# Altium schematic sheet [03] - MCU.SchDoc: MCU
size A3; Author: Gabriel Piñango; DocumentNumber: 3; Revision: V1I1; SheetNumber: 3; SheetTotal: 6; Collaborator: Gabriel Pinango; Project: MultiTestcard; VersionRevision: V1I1; Designer: Gabriel Pinango
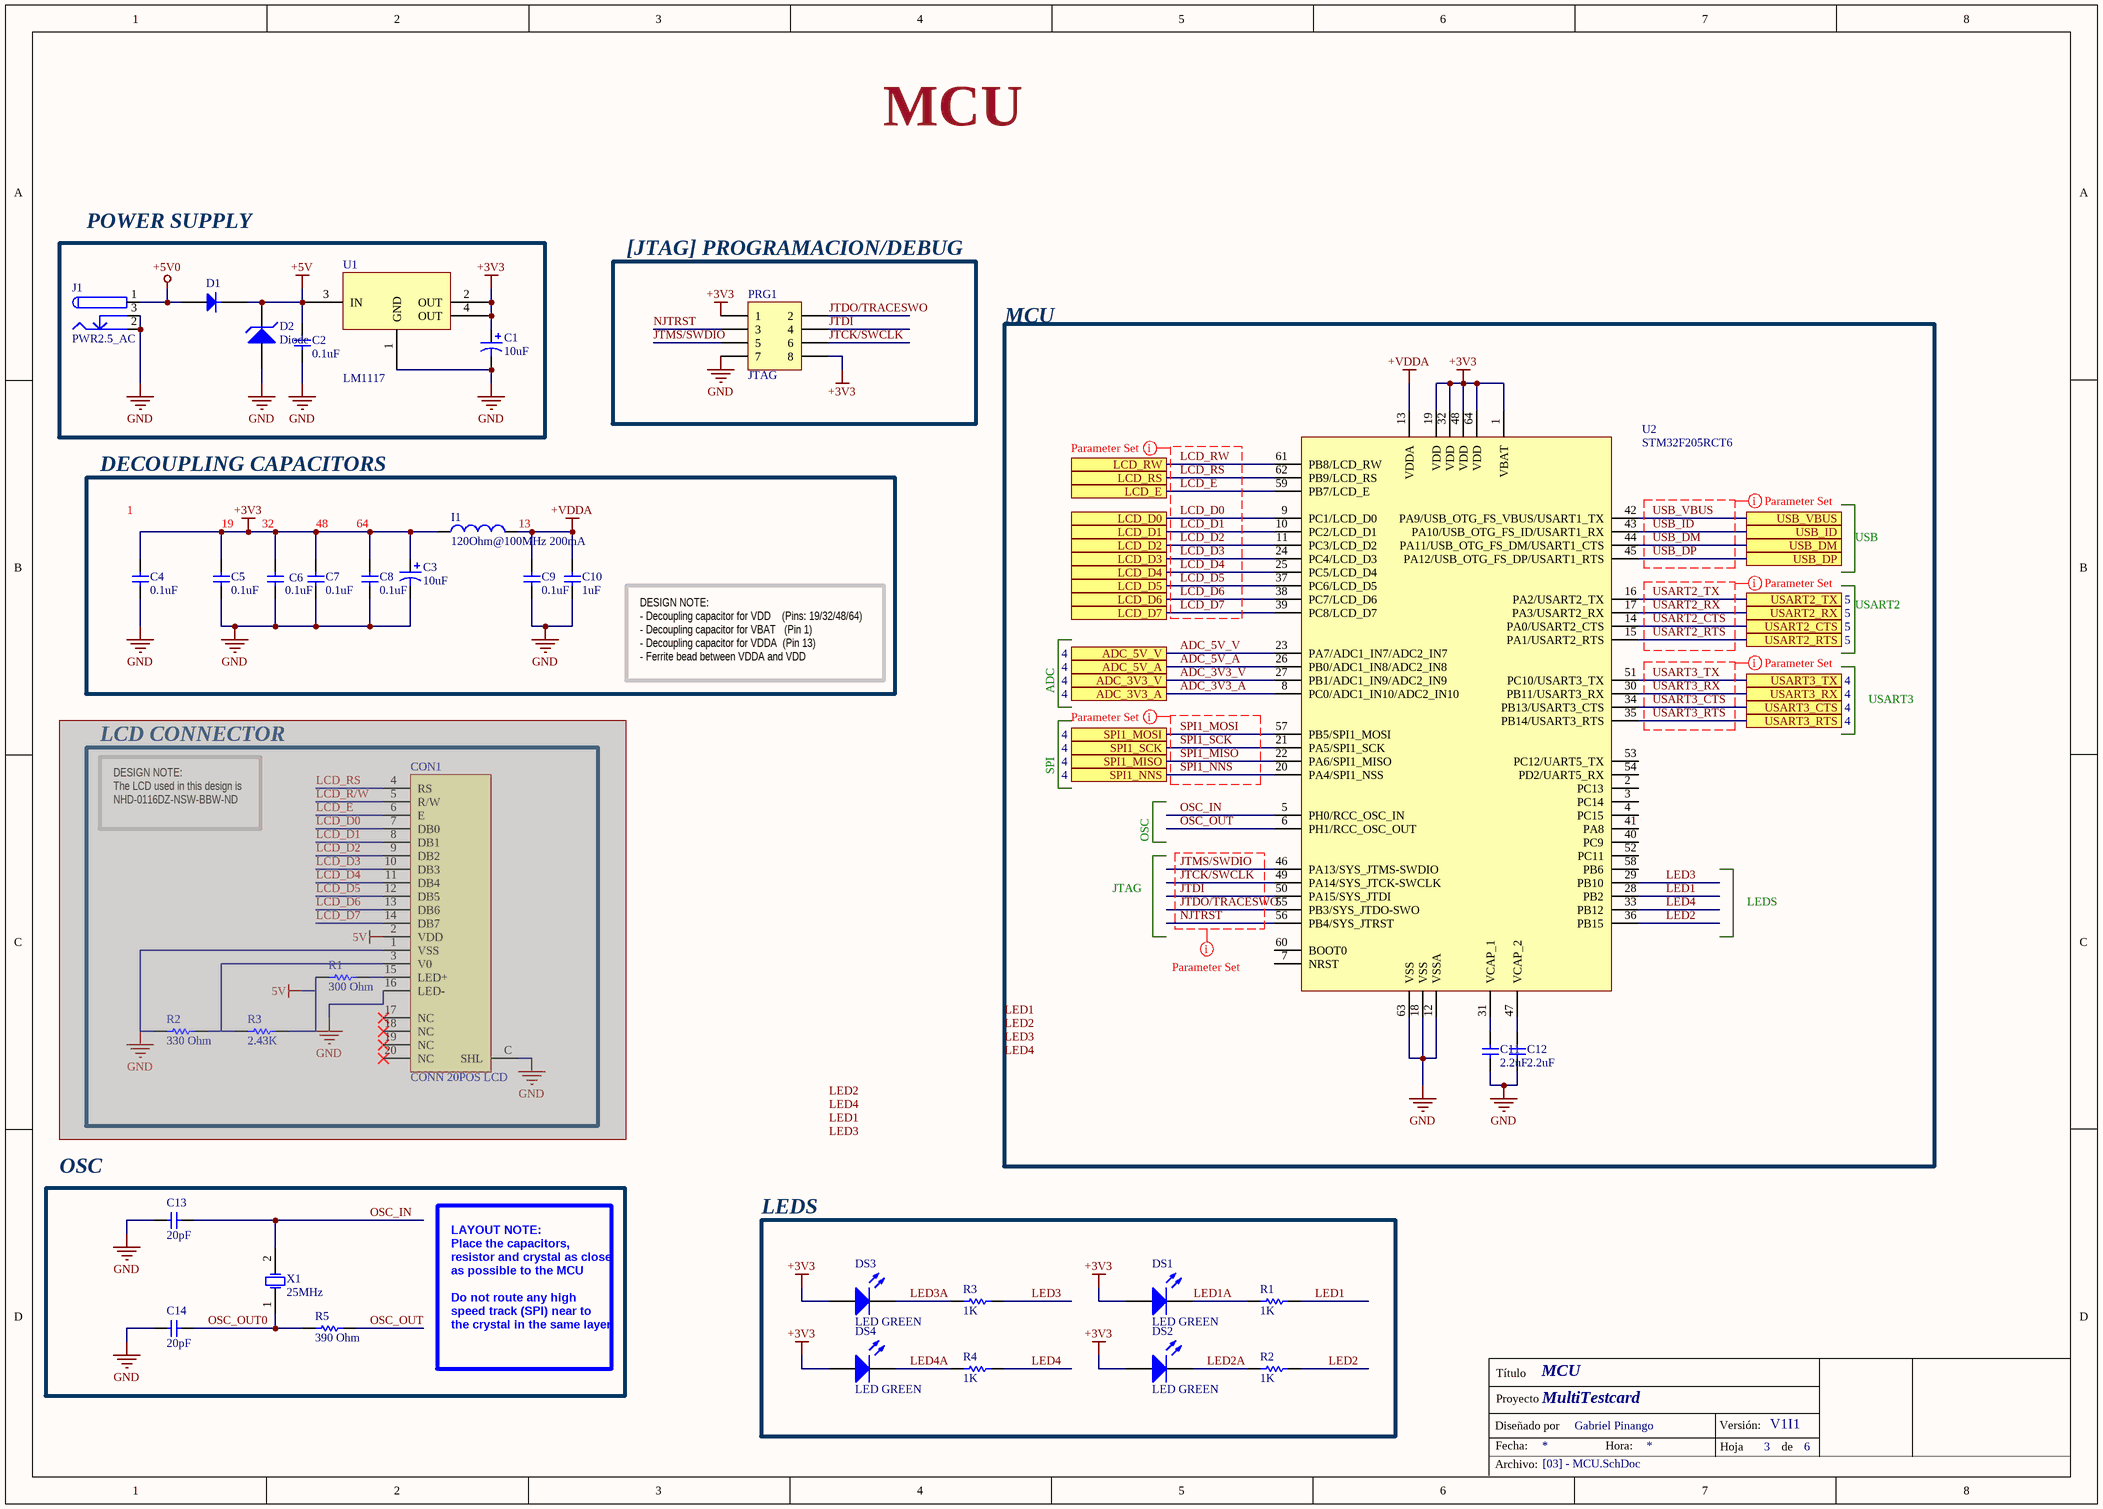
[diagram p0: [03] - MCU.SchDoc]

## Parts
(Parts that share a designator on the sheet are numbered #1, #2 ... from top to bottom, then left to right.)
C1  10uF  [CC2012-0805]
C2  0.1uF  [CC-0603]
C3  10uF  [CC2012-0805]
C4  0.1uF  [CC-0603]
C5  0.1uF  [CC-0603]
C6  0.1uF  [CC-0603]
C7  0.1uF  [CC-0603]
C8  0.1uF  [CC-0603]
C9  0.1uF  [CC-0603]
C10  1uF  [CC-0603]
C11  2.2uF  [CC-0603]
C12  2.2uF  [CC-0603]
C13  20pF  [CC-0603]
C14  20pF  [CC-0603]
CON1  CONN 20POS LCD  [CON20_1X20_DUT_58XF_GLE]  (masked out: inside a compile mask, not in the netlist)
D1  1N4148W-TP  [SOD123]  (value not drawn)
D2  Diode  [SOD-523]
DS1  LED GREEN  [LED-SMD-0805]
DS2  LED GREEN  [LED-SMD-0805]
DS3  LED GREEN  [LED-SMD-0805]
DS4  LED GREEN  [LED-SMD-0805]
I1  120Ohm@100MHz 200mA  [L-0805]
J1  PWR2.5_AC  [KLD-0202-AC]
PRG1  JTAG  [20021311-00008T4LF]
R1#1  300 Ohm  [R-0603]  (masked out: inside a compile mask, not in the netlist)
R1#2  1K  [R-0603]
R2#1  330 Ohm  [R-0603]  (masked out: inside a compile mask, not in the netlist)
R2#2  1K  [R-0603]
R3#1  2.43K  [R-0603]  (masked out: inside a compile mask, not in the netlist)
R3#2  1K  [R-0603]
R4  1K  [R-0603]
R5  390 Ohm  [R-0603]
U1  LM1117  [SOT223]
U2  STM32F205RCT6  [64-LQFP]
X1  25MHz  [ABM3 CRYSTAL]

## Blocks framed on the sheet
POWER SUPPLY: C1 C2 D1 D2 J1 U1
[JTAG] PROGRAMACION/DEBUG: PRG1
MCU: C11 C12 U2
DECOUPLING CAPACITORS: C3-C10 I1
LCD CONNECTOR: CON1 R1#1 R2#1 R3#1
OSC: C13 C14 R5 X1
LEDS: DS1-DS4 R1#2 R2#2 R3#2 R4

## Ports
ADC_3V3_A (see 4), ADC_3V3_V (see 4), ADC_5V_A (see 4), ADC_5V_V (see 4), LCD_D0, LCD_D1, LCD_D2, LCD_D3, LCD_D4, LCD_D5, LCD_D6, LCD_D7, LCD_E, LCD_RS, LCD_RW, SPI1_MISO (see 4), SPI1_MOSI (see 4), SPI1_NNS (see 4), SPI1_SCK (see 4), USART2_CTS (see 5), USART2_RTS (see 5), USART2_RX (see 5), USART2_TX (see 5), USART3_CTS (see 4), USART3_RTS (see 4), USART3_RX (see 4), USART3_TX (see 4), USB_DM, USB_DP, USB_ID, USB_VBUS

## Nets
+3V3: C1.1 C3.1 C4.1 C5.1 C6.1 C7.1 C8.1 DS1.2(A) DS2.2(A) DS3.2(A) DS4.2(A) I1.1 PRG1.1 PRG1.8 U1.2(OUT) U1.4(OUT) U2.1(VBAT) U2.19(VDD) U2.32(VDD) U2.48(VDD) U2.64(VDD)
+5V: C2.1 D1.2(K) D2.2(K) U1.3(IN)
+5V0: D1.1(A) J1.1
+VDDA: C9.1 C10.1 I1.2 U2.13(VDDA)
GND: C1.2 C2.2 C3.2 C4.2 C5.2 C6.2 C7.2 C8.2 C9.2 C10.2 C11.2 C12.2 C13.2 C14.2 D2.1(A) J1.2 J1.3 PRG1.7 U1.1(GND) U2.12(VSSA) U2.18(VSS) U2.63(VSS)
ADC_3V3_A: U2.8(PC0/ADC1_IN10/ADC2_IN10) ; port ADC_3V3_A
ADC_3V3_V: U2.27(PB1/ADC1_IN9/ADC2_IN9) ; port ADC_3V3_V
ADC_5V_A: U2.26(PB0/ADC1_IN8/ADC2_IN8) ; port ADC_5V_A
ADC_5V_V: U2.23(PA7/ADC1_IN7/ADC2_IN7) ; port ADC_5V_V
JTCK/SWCLK: PRG1.6 U2.49(PA14/SYS_JTCK-SWCLK)
JTDI: PRG1.4 U2.50(PA15/SYS_JTDI)
JTDO/TRACESWO: PRG1.2 U2.55(PB3/SYS_JTDO-SWO)
JTMS/SWDIO: PRG1.5 U2.46(PA13/SYS_JTMS-SWDIO)
LCD_D0: U2.9(PC1/LCD_D0) ; port LCD_D0
LCD_D1: U2.10(PC2/LCD_D1) ; port LCD_D1
LCD_D2: U2.11(PC3/LCD_D2) ; port LCD_D2
LCD_D3: U2.24(PC4/LCD_D3) ; port LCD_D3
LCD_D4: U2.25(PC5/LCD_D4) ; port LCD_D4
LCD_D5: U2.37(PC6/LCD_D5) ; port LCD_D5
LCD_D6: U2.38(PC7/LCD_D6) ; port LCD_D6
LCD_D7: U2.39(PC8/LCD_D7) ; port LCD_D7
LCD_E: U2.59(PB7/LCD_E) ; port LCD_E
LCD_RS: U2.62(PB9/LCD_RS) ; port LCD_RS
LCD_RW: U2.61(PB8/LCD_RW) ; port LCD_RW
LED1: R1#2.2 U2.28(PB2)
LED1A: DS1.1(K) R1#2.1
LED2: R2#2.2 U2.36(PB15)
LED2A: DS2.1(K) R2#2.1
LED3: R3#2.2 U2.29(PB10)
LED3A: DS3.1(K) R3#2.1
LED4: R4.2 U2.33(PB12)
LED4A: DS4.1(K) R4.1
NJTRST: PRG1.3 U2.56(PB4/SYS_JTRST)
OSC_IN: C13.1 U2.5(PH0/RCC_OSC_IN) X1.2(OSC2)
OSC_OUT: R5.2 U2.6(PH1/RCC_OSC_OUT)
OSC_OUT0: C14.1 R5.1 X1.1(OSC1)
SPI1_MISO: U2.22(PA6/SPI1_MISO) ; port SPI1_MISO
SPI1_MOSI: U2.57(PB5/SPI1_MOSI) ; port SPI1_MOSI
SPI1_NNS: U2.20(PA4/SPI1_NSS) ; port SPI1_NNS
SPI1_SCK: U2.21(PA5/SPI1_SCK) ; port SPI1_SCK
USART2_CTS: U2.14(PA0/USART2_CTS) ; port USART2_CTS
USART2_RTS: U2.15(PA1/USART2_RTS) ; port USART2_RTS
USART2_RX: U2.17(PA3/USART2_RX) ; port USART2_RX
USART2_TX: U2.16(PA2/USART2_TX) ; port USART2_TX
USART3_CTS: U2.34(PB13/USART3_CTS) ; port USART3_CTS
USART3_RTS: U2.35(PB14/USART3_RTS) ; port USART3_RTS
USART3_RX: U2.30(PB11/USART3_RX) ; port USART3_RX
USART3_TX: U2.51(PC10/USART3_TX) ; port USART3_TX
USB_DM: U2.44(PA11/USB_OTG_FS_DM/USART1_CTS) ; port USB_DM
USB_DP: U2.45(PA12/USB_OTG_FS_DP/USART1_RTS) ; port USB_DP
USB_ID: U2.43(PA10/USB_OTG_FS_ID/USART1_RX) ; port USB_ID
USB_VBUS: U2.42(PA9/USB_OTG_FS_VBUS/USART1_TX) ; port USB_VBUS
NetC11_1: C11.1 U2.31(VCAP_1)
NetC12_1: C12.1 U2.47(VCAP_2)

Not connected (* = marked no-connect by the designer): U2 2(PC13) 3(PC14) 4(PC15) 7(NRST) 40(PC9) 41(PA8) 52(PC11) 53(PC12/UART5_TX) 54(PD2/UART5_RX) 58(PB6) 60(BOOT0)

## Layout directives
net class USART2: USART2_CTS, USART2_RTS, USART2_RX, USART2_TX
net class USB: USB_DM, USB_DP, USB_ID, USB_VBUS
net class USART3: USART3_CTS, USART3_RTS, USART3_RX, USART3_TX
net class SPI1: SPI1_MISO, SPI1_MOSI, SPI1_NNS, SPI1_SCK
net class JTAG: JTCK/SWCLK, JTDI, JTDO/TRACESWO, JTMS/SWDIO, NJTRST
net class LCD: LCD_D0, LCD_D1, LCD_D2, LCD_D3, LCD_D4, LCD_D5, LCD_D6, LCD_D7, LCD_E, LCD_RS, LCD_RW

## Notes on the sheet
- MCU
- 1
- 19
- 32
- 48
- 64
- (near I1) 13
- USB
- USART2
- DESIGN NOTE:
  - Decoupling capacitor for VDD    (Pins: 19/32/48/64)
  - Decoupling capacitor for VBAT   (Pin 1)
  - Decoupling capacitor for VDDA  (Pin 13)
  - Ferrite bead between VDDA and VDD
- ADC
- USART3
- SPI
- DESIGN NOTE:
  The LCD used in this design is NHD-0116DZ-NSW-BBW-ND
- OSC
- JTAG
- LEDS
- LAYOUT NOTE:
  Place the capacitors, resistor and crystal as close as possible to the MCU
  Do not route any high speed track (SPI) near to the crystal in the same layer
- Labels drawn without touching a wire or pin: LED1, LED2, LED3, LED4
- Título
- Diseñado por
- Fecha:
- Proyecto
- Hora:
- Versión:
- Hoja
- de
- Archivo:

## Library data of the parts
C1 C3 = TCP0J106M8R: CAP TANT 10UF 6.3V 20% 0805; Manufacturer: Rohm; ESR (Equivalent Series Resistance): 8.3R; Supplier 1: Digi-Key; Supplier Part Number 1: 511-1447-6-ND; Manufacturer Part Number: TCP0J106M8R; Stock 1: 89891; Pricing 1: 1=0.46, 10=0.316, 100=0.1898, 500=0.1423, 1000=0.1202 (USD); Mount: Surface Mount; Case/Package: 0805; Case Code (Metric): 2012; Case Code (Imperial): 0805; Min Operating Temperature: -55°C; Max Operating Temperature: 125°C; Capacitance: 10uF; Tolerance: 20%; Package Quantity: 1; Voltage Rating: 6.3V; Packaging: Tape and Reel; Voltage Rating (DC): 6.3V; Features: General Purpose; Length: 0.079inch; Width: 0.049inch; Height - Seated (Max): 0.047inch; Lead Free: Lead Free; ComponentLink1URL: http://rohmfs.rohm.com/en/products/databook/datasheet/passive/tantalum_capacitor/tantalum_chip_capacitor/tc_p.pdf?src-supplier=Future+Electronics; ComponentLink1Description: http://rohmfs.rohm.com/en/products/databook/datasheet/passive/tantalum_capacitor/tantalum_chip_capacitor/tc_p.pdf?src-supplier=Future+Electronics
C2 C4-C9 = CGA3E2X7R1H104K080AA: CAP CER 0.1uF 50V X7R 0603; Manufacturer: TDK; Capacitance: 100nF; Tolerance: 10%; Supplier 1: Digi-Key; Manufacturer Part Number: CGA3E2X7R1H104K080AA; Stock 1: 11580568; Pricing 1: 1=0.1, 10=0.075, 100=0.0335, 500=0.0239, 1000=0.0188 (USD); Mount: Surface Mount; Case/Package: 0603; Case Code (Metric): 1608; Case Code (Imperial): 0603; Min Operating Temperature: -55°C; Max Operating Temperature: 125°C; Package Quantity: 1; Voltage Rating: 50V; Packaging: Tape and Reel; Dielectric: X7R; Termination: SMD/SMT; Voltage: 50V; Length: 1.6mm; Height: 0.8mm; Width: 0.8mm; Thickness: 0.035inch; Depth: 0.8mm; Radiation Hardening: No; REACH SVHC: No SVHC; Lead Free: Lead Free; ComponentLink1URL: http://www.farnell.com/datasheets/1796654.pdf?src-supplier=Mouser; ComponentLink1Description: http://www.farnell.com/datasheets/1796654.pdf?src-supplier=Mouser; ComponentLink2URL: http://product.tdk.com/capacitor/mlcc/en/documents/mlccspec_automotive_general_midvoltage_en.pdf?src-supplier=Future+Electronics; ComponentLink2Description: http://product.tdk.com/capacitor/mlcc/en/documents/mlccspec_automotive_general_midvoltage_en.pdf?src-supplier=Future+Electronics; ComponentLink3URL: http://www.farnell.com/datasheets/1735392.pdf?src-supplier=Element14; ComponentLink3Description: http://www.farnell.com/datasheets/1735392.pdf?src-supplier=Element14; ComponentLink4URL: https://www.verical.com/server-webapp/html/getDatasheet?partID=715867&src-supplier=Verical; ComponentLink4Description: https://www.verical.com/server-webapp/html/getDatasheet?partID=715867&src-supplier=Verical; Supplier Part Number 1: 445-5666-6-ND; Weight: 7.1E-05oz; Voltage Rating (DC): 50V; Composition: Ceramic; Ratings: AEC-Q200; ComponentLink5URL: http://www.farnell.com/datasheets/1796654.pdf?src-supplier=Newark; ComponentLink5Description: http://www.farnell.com/datasheets/1796654.pdf?src-supplier=Newark
C10 = C1608X5R1H105K080AB: CAP CER 1uF 50V X5R 0603; Manufacturer: TDK; Dielectric Material: Ceramic; Tolerance: 10%; Supplier 1: Digi-Key; Manufacturer Part Number: C1608X5R1H105K080AB; Stock 1: 233012; Pricing 1: 1=0.25, 10=0.171, 100=0.0865, 500=0.0592, 1000=0.0524 (USD); Mount: Surface Mount; Case/Package: 0603; Number of Pins: 2; Weight: 7.1E-05oz; Case Code (Metric): 1608; Case Code (Imperial): 0603; Min Operating Temperature: -55°C; Max Operating Temperature: 85°C; Capacitance: 1uF; Packaging: Tape and Reel; Voltage Rating: 50V; Package Quantity: 1; Voltage Rating (DC): 50V; Dielectric: X5R; Termination: SMD/SMT; Voltage: 50V; Composition: Ceramic; Length: 1.6mm; Height: 0.8mm; Width: 0.031inch; Thickness: 0.035inch; Depth: 0.8mm; Radiation Hardening: No; REACH SVHC: No SVHC; Lead Free: Lead Free; ComponentLink1URL: http://www.tdk.co.jp/tefe02/e412_c.pdf?src-supplier=Avnet+Europe; ComponentLink1Description: http://www.tdk.co.jp/tefe02/e412_c.pdf?src-supplier=Avnet+Europe; ComponentLink2URL: https://product.tdk.com/info/en/catalog/spec/mlccspec_commercial_general_midvoltage_en.pdf?src-supplier=Digi-Key; ComponentLink2Description: https://product.tdk.com/info/en/catalog/spec/mlccspec_commercial_general_midvoltage_en.pdf?src-supplier=Digi-Key; ComponentLink3URL: http://www.farnell.com/datasheets/1913358.pdf?src-supplier=Element14; ComponentLink3Description: http://www.farnell.com/datasheets/1913358.pdf?src-supplier=Element14; Supplier Part Number 1: 445-7468-6-ND
C11 C12 = C0603C225K4PACTU: KEMET - C0603C225K4PACTU - CAP, MLCC, X5R, 2.2UF, 16V, 0603; Dielectric Material: Ceramic; Tolerance: 10%; Dissipation Factor: 5%; Supplier 1: Digi-Key; Manufacturer: KEMET; Manufacturer Part Number: C0603C225K4PACTU; Stock 1: 49901; Pricing 1: 1=0.16, 10=0.112, 100=0.0528, 500=0.037, 1000=0.0307 (USD); Mount: Surface Mount; Case/Package: 0603; Number of Pins: 2; Case Code (Imperial): 0603; Case Code (Metric): 1608; Contact Plating: Tin,Matte; Min Operating Temperature: -55°C; Max Operating Temperature: 85°C; Capacitance: 2.2uF; Voltage Rating: 16V; Voltage Rating (DC): 16V; Packaging: Tape and Reel; Package Quantity: 1; Dielectric: X5R; Termination: SMD/SMT; Voltage: 16V; Length: 1.6mm; Height: 0.8mm; Width: 0.8mm; Thickness: 0.034inch; Depth: 0.8mm; Radiation Hardening: No; REACH SVHC: No SVHC; Lead Free: Lead Free; ComponentLink1URL: http://www.farnell.com/datasheets/2739684.pdf?src-supplier=Farnell; ComponentLink1Description: http://www.farnell.com/datasheets/2739684.pdf?src-supplier=Farnell; ComponentLink2URL: http://www.farnell.com/datasheets/2123797.pdf?src-supplier=Element14; ComponentLink2Description: http://www.farnell.com/datasheets/2123797.pdf?src-supplier=Element14; Supplier Part Number 1: 399-7886-1-ND
C13 C14 = CC0603JRNPO9BN200: CAP CER 20PF 50V C0G/NPO 0603; Manufacturer: Yageo; Tolerance: 5%; Dielectric: C0G; Supplier 1: Digi-Key; Manufacturer Part Number: CC0603JRNPO9BN200; Stock 1: 223075; Pricing 1: 1=0.1, 10=0.048, 100=0.0214, 500=0.0153, 1000=0.012 (USD); Mount: Surface Mount; Case/Package: 0603; Number of Pins: 2; Weight: 7.1E-05oz; Case Code (Imperial): 0603; Case Code (Metric): 1608; Min Operating Temperature: -55°C; Max Operating Temperature: 125°C; Capacitance: 20pF; Package Quantity: 4000; Voltage Rating (DC): 50V; Packaging: Tape and Reel; Voltage Rating: 50V; Termination: SMD/SMT; Composition: Ceramic; Length: 1.6mm; Width: 0.8mm; Thickness: 0.035inch; Depth: 0.8mm; REACH SVHC: Unknown; Lead Free: Lead Free; ComponentLink1URL: http://www.farnell.com/datasheets/1132289.pdf?src-supplier=Element14; ComponentLink1Description: http://www.farnell.com/datasheets/1132289.pdf?src-supplier=Element14; ComponentLink2URL: http://www.yageo.com/documents/recent/UPY-GP_NP0_16V-to-50V_16.pdf?src-supplier=Digi-Key; ComponentLink2Description: http://www.yageo.com/documents/recent/UPY-GP_NP0_16V-to-50V_16.pdf?src-supplier=Digi-Key; Supplier Part Number 1: 311-1424-6-ND
CON1 = 62674-201121ALF: CONN FFC VERT 20POS 0.50MM SMD; Manufacturer: Amphenol FCI; Actuator Material: Plastic,Glass; Contact Resistance: 30mR; Voltage Rating: 50V; Current Rating: 500mA; Gender: Receptacle; Number of Positions: 20; Insulation Resistance: 100MR; Wire/Cable Type: Straight; Pitch: 1mm; Supplier 1: Digi-Key; Manufacturer Part Number: 62674-201121ALF; Stock 1: 37230; Pricing 1: 1=0.74, 10=0.65, 25=0.6124, 50=0.5868, 100=0.5612, 250=0.5102, 500=0.4592 (USD); Mount: Surface Mount; Contact Material: Bronze; Contact Plating: Gold; Housing Color: Black; Housing Material: Resin; Min Operating Temperature: -55°C; Max Operating Temperature: 85°C; Number of Rows: 1; Packaging: Tape and Reel; Package Quantity: 1000; Termination: Solder; Max Voltage Rating (AC): 50V; Max Voltage Rating (DC): 50V; Number of Contacts: 20; Orientation: Straight; Length: 14.5mm; Depth: 2.95mm; Width: 2.95mm; Radiation Hardening: No; REACH SVHC: No SVHC; Lead Free: Lead Free; Flammability Rating: UL94 V-0; ComponentLink1URL: http://www.mouser.com/ds/2/154/62674-26092.pdf?src-supplier=Mouser; ComponentLink1Description: http://www.mouser.com/ds/2/154/62674-26092.pdf?src-supplier=Mouser; ComponentLink2URL: http://portal.fciconnect.com/Comergent//fci/drawing/62674.pdf?src-supplier=Digi-Key; ComponentLink2Description: http://portal.fciconnect.com/Comergent//fci/drawing/62674.pdf?src-supplier=Digi-Key; ComponentLink3URL: https://cdn.amphenol-icc.com/media/wysiwyg/files/drawing/62674.pdf?src-supplier=Digi-Key; ComponentLink3Description: https://cdn.amphenol-icc.com/media/wysiwyg/files/drawing/62674.pdf?src-supplier=Digi-Key; ComponentLink4URL: http://portal.fciconnect.com/Comergent/fci/drawing/62674.pdf?src-supplier=Avnet; ComponentLink4Description: http://portal.fciconnect.com/Comergent/fci/drawing/62674.pdf?src-supplier=Avnet; ComponentLink5URL: http://portal.fciconnect.com/Comergent/fci/drawing/62674.pdf?src-supplier=Avnet+Asia; ComponentLink5Description: http://portal.fciconnect.com/Comergent/fci/drawing/62674.pdf?src-supplier=Avnet+Asia; Supplier Part Number 1: 609-1207-1-ND
D1 = 1N4148W-TP: DIODE SWITCH 100V 0.15A SOD123; Manufacturer: MCC; Max Current Consumption: 1uA; Max Surge Current: 2A; Forward Voltage: 1V; Forward Current: 150mA; Recovery Time: 4ns; Max Reverse Leakage Current: 5uA; Power Dissipation: 400mW; Max Forward Surge Current (Ifsm): 1A; Element Configuration: Single; Polarity: Standard; Capacitance: 4pF; Supplier 1: Digi-Key; Supplier Part Number 1: 1N4148WTPMSCT-ND; Manufacturer Part Number: 1N4148W-TP; Stock 1: 337039; Pricing 1: 1=0.17, 10=0.158, 100=0.066, 500=0.0518, 1000=0.036 (USD); Mount: Surface Mount; Number of Pins: 2; Min Operating Temperature: -65°C; Max Operating Temperature: 150°C; Packaging: Tape and Reel; Package Quantity: 3000; Average Rectified Current: 150mA; Reverse Recovery Time: 4ns; Max Repetitive Reverse Voltage (Vrrm): 100V; Peak Non-Repetitive Surge Current: 2A; Voltage Rating (DC): 100V; Current Rating: 150mA; Output Current: 150mA; Max Reverse Voltage (DC): 100V; Length: 2.85mm; Width: 1.8mm; Height: 1.2mm; Radiation Hardening: No; REACH SVHC: Unknown; Lead Free: Lead Free; ComponentLink1URL: http://www.farnell.com/datasheets/1684829.pdf?src-supplier=Newark; ComponentLink1Description: http://www.farnell.com/datasheets/1684829.pdf?src-supplier=Newark; ComponentLink2URL: http://www.mccsemi.com/up_pdf/1N4148W(SOD123).pdf?src-supplier=Future+Electronics; ComponentLink2Description: http://www.mccsemi.com/up_pdf/1N4148W(SOD123).pdf?src-supplier=Future+Electronics; ComponentLink3URL: http://www.mouser.com/ds/2/258/1N4148W(SOD123)-349435.pdf?src-supplier=Mouser; ComponentLink3Description: http://www.mouser.com/ds/2/258/1N4148W(SOD123)-349435.pdf?src-supplier=Mouser; ComponentLink4URL: http://www.alliedelec.com/images/products/datasheets/bm/MCC/70055519.pdf?src-supplier=Allied+Electronics; ComponentLink4Description: http://www.alliedelec.com/images/products/datasheets/bm/MCC/70055519.pdf?src-supplier=Allied+Electronics; ComponentLink5URL: http://www.mccsemi.com/up_pdf/1N4148W(SOD123).pdf?src-supplier=Digi-Key; ComponentLink5Description: http://www.mccsemi.com/up_pdf/1N4148W(SOD123).pdf?src-supplier=Digi-Key; ComponentLink6URL: http://www.farnell.com/datasheets/1684829.pdf?src-supplier=Element14; ComponentLink6Description: http://www.farnell.com/datasheets/1684829.pdf?src-supplier=Element14
D2 = UCLAMP0501H.TCT: TVS DIODE 5VWM 12.5VC SOD523; Manufacturer: Semtech; Capacitance: 160pF; Number of Channels: 1; Direction: Unidirectional; Reverse Breakdown Voltage: 6V; Reverse Standoff Voltage: 5V; Clamping Voltage: 12.5V; Peak Pulse Power: 240W; Power Line Protection: No; Leakage Current: 5uA; Peak Pulse Current: 16A; Test Current: 1mA; Element Configuration: Single; Supplier 1: Digi-Key; Supplier Part Number 1: UCLAMP0501HDKR-ND; Manufacturer Part Number: UCLAMP0501H.TCT; Stock 1: 29145; Pricing 1: 1=0.58, 10=0.51, 25=0.4788, 100=0.3909, 250=0.3631, 500=0.309, 1000=0.2472 (USD); Mount: Surface Mount; Number of Pins: 2; Min Operating Temperature: -55°C; Max Operating Temperature: 125°C; Packaging: Tape and Reel; Number of Elements: 1; Number of Unidirectional Channels: 1; Min Breakdown Voltage: 6V; Max Breakdown Voltage: 6V; Working Voltage: 5V; Polarity: Unidirectional; Breakdown Voltage: 6V; Max Power Dissipation: 240W; Voltage Rating (DC): 5V; Composition: Zener; Length: 1.3mm; Depth: 0.9mm; Width: 900um; Radiation Hardening: No; REACH SVHC: No SVHC; Lead Free: Lead Free; ComponentLink1URL: http://www.semtech.com/images/datasheet/uclamp0501h.pdf?src-supplier=Future+Electronics; ComponentLink1Description: http://www.semtech.com/images/datasheet/uclamp0501h.pdf?src-supplier=Future+Electronics; ComponentLink2URL: https://www.verical.com/server-webapp/html/getDatasheet?partID=51047&src-supplier=Verical; ComponentLink2Description: https://www.verical.com/server-webapp/html/getDatasheet?partID=51047&src-supplier=Verical; ComponentLink3URL: http://www.semtech.com/images/datasheet/uclamp0501h.pdf?src-supplier=Digi-Key; ComponentLink3Description: http://www.semtech.com/images/datasheet/uclamp0501h.pdf?src-supplier=Digi-Key; ComponentLink4URL: https://www.semtech.com/uploads/documents/uclamp0501h.pdf?src-supplier=Digi-Key; ComponentLink4Description: https://www.semtech.com/uploads/documents/uclamp0501h.pdf?src-supplier=Digi-Key; ComponentLink5URL: http://www.semtech.com/images/datasheet/uclamp0501h.pdf?src-supplier=Element14; ComponentLink5Description: http://www.semtech.com/images/datasheet/uclamp0501h.pdf?src-supplier=Element14; ComponentLink6URL: http://www.farnell.com/datasheets/1796175.pdf?src-supplier=Element14; ComponentLink6Description: http://www.farnell.com/datasheets/1796175.pdf?src-supplier=Element14; ComponentLink7URL: http://www.semtech.com/images/datasheet/uclamp0501h.pdf?src-supplier=Avnet; ComponentLink7Description: http://www.semtech.com/images/datasheet/uclamp0501h.pdf?src-supplier=Avnet
DS1-DS4 = LGR971-KN-1: LED Uni-Color Green 572nm 2-Pin SMD T/R; Manufacturer: Osram Opto; Lens Color: White; Forward Current: 25mA; Forward Voltage: 2.2V; Lens Style: Diffused,Flat,Colorless,Rectangular; Luminous Intensity: 45mcd; Viewing Angle: 160°; Test Current: 20mA; Dominant Wavelength: 570nm; Lens Transparency: Diffused; Luminous Flux: 0.1lm; Number of Elements: 1; Power Dissipation: 65mW; Reverse Voltage: 12V; Lens Size: 1.25mm; Supplier 1: Digi-Key; Manufacturer Part Number: LGR971-KN-1; Stock 1: 173237; Pricing 1: 1=0.31, 10=0.229, 100=0.1083, 500=0.0722, 1000=0.0566 (USD); Mount: Surface Mount; Case/Package: 0805; Number of Pins: 2; Color: Green; Case Code (Metric): 2012; Case Code (Imperial): 0805; Min Operating Temperature: -30°C; Max Operating Temperature: 85°C; Packaging: Tape and Reel; Package Quantity: 1; Illumination Color: Green; Number of LEDs: 1; Length: 2.1mm; Height: 0.9mm; Width: 1.25mm; Depth: 1.35mm; Radiation Hardening: No; ComponentLink1URL: https://www.verical.com/server-webapp/html/getDatasheet?partID=233880&src-supplier=Verical; ComponentLink1Description: https://www.verical.com/server-webapp/html/getDatasheet?partID=233880&src-supplier=Verical; ComponentLink2URL: https://www.verical.com/server-webapp/html/getDatasheet?partID=462214&src-supplier=Verical; ComponentLink2Description: https://www.verical.com/server-webapp/html/getDatasheet?partID=462214&src-supplier=Verical; ComponentLink3URL: https://dammedia.osram.info/media/resource/hires/osram-dam-2493936/LG%20R971.pdf?src-supplier=Digi-Key; ComponentLink3Description: https://dammedia.osram.info/media/resource/hires/osram-dam-2493936/LG%20R971.pdf?src-supplier=Digi-Key; ComponentLink4URL: http://www.mouser.com/ds/2/311/LG%20R971%20-%20CHIPLED%200805-318376.pdf?src-supplier=Mouser; ComponentLink4Description: http://www.mouser.com/ds/2/311/LG%20R971%20-%20CHIPLED%200805-318376.pdf?src-supplier=Mouser; Supplier Part Number 1: 475-1410-6-ND
I1 = BLM21AG121SN1D: FERRITE BEAD 120 OHM 0805 1LN; Manufacturer: Murata; Resistance: 150mR; Impedance: 120R; Tolerance: 25%; Current Rating: 800mA; Max Current Rating: 1A; DC Resistance (DCR): 100mR; Test Frequency: 100MHz; Number of Lines: 1; Shielding: Unshielded; Supplier 1: Digi-Key; Manufacturer Part Number: BLM21AG121SN1D; Stock 1: 40999; Pricing 1: 1=0.15, 10=0.119, 25=0.0924, 50=0.0766, 100=0.066, 250=0.0528, 500=0.0475, 1000=0.0396 (USD); Case/Package: 0805; Number of Pins: 2; Core Material: Ferrite; Case Code (Metric): 2012; Case Code (Imperial): 0805; Material: Steel,Ferrite; Min Operating Temperature: -55°C; Max Operating Temperature: 125°C; Package Quantity: 1; Packaging: Tape and Reel; Max DC Current: 200mA; Termination: SMD/SMT; DC Current: 200mA; Military Standard: Not; Frequency: 100MHz; Number of Circuits: 1; Length: 2mm; Height: 0.85mm; Width: 1.25mm; Depth: 1.25mm; Radiation Hardening: No; REACH SVHC: No SVHC; Lead Free: Lead Free; ComponentLink1URL: http://www.farnell.com/datasheets/1914683.pdf?src-supplier=Farnell; ComponentLink1Description: http://www.farnell.com/datasheets/1914683.pdf?src-supplier=Farnell; ComponentLink2URL: http://search.murata.co.jp/Ceramy/image/img/PDF/ENG/L0110S0100BLM21A.pdf?src-supplier=Future+Electronics; ComponentLink2Description: http://search.murata.co.jp/Ceramy/image/img/PDF/ENG/L0110S0100BLM21A.pdf?src-supplier=Future+Electronics; ComponentLink3URL: https://www.murata.com/en-us/products/productdata/8796738977822/ENFA0005.pdf?src-supplier=Avnet; ComponentLink3Description: https://www.murata.com/en-us/products/productdata/8796738977822/ENFA0005.pdf?src-supplier=Avnet; ComponentLink4URL: https://www.murata.com/en-us/products/productdata/8796738977822/ENFA0005.pdf?src-supplier=Avnet+Europe; ComponentLink4Description: https://www.murata.com/en-us/products/productdata/8796738977822/ENFA0005.pdf?src-supplier=Avnet+Europe; ComponentLink5URL: https://www.murata.com/en-us/products/productdata/8796738977822/ENFA0005.pdf?src-supplier=Digi-Key; ComponentLink5Description: https://www.murata.com/en-us/products/productdata/8796738977822/ENFA0005.pdf?src-supplier=Digi-Key; ComponentLink6URL: http://www.produktinfo.conrad.com/datenblaetter/1100000-1199999/001172324-da-01-en-DROSSEL_0805_120R_2_0X1_25MM_4000ST.pdf?src-supplier=Conrad; ComponentLink6Description: http://www.produktinfo.conrad.com/datenblaetter/1100000-1199999/001172324-da-01-en-DROSSEL_0805_120R_2_0X1_25MM_4000ST.pdf?src-supplier=Conrad; ComponentLink7URL: http://www.produktinfo.conrad.com/datenblaetter/425000-449999/442447-da-01-en-CHIP_DROSSEL_0805_120R_200MA_2_0X1_25MM.pdf?src-supplier=Conrad; ComponentLink7Description: http://www.produktinfo.conrad.com/datenblaetter/425000-449999/442447-da-01-en-CHIP_DROSSEL_0805_120R_200MA_2_0X1_25MM.pdf?src-supplier=Conrad; Supplier Part Number 1: 490-1038-1-ND
J1 = PWR2.5_AC: CONN POWER JACK 2.1MM; Manufacturer: CUI Inc; Manufacturer Part Number: PJ-002A; Gender: Male; Shielding: Unshielded; Current Rating: 2.5A; Voltage Rating: 24V; Insulation Resistance: 50MR; Number of Conductors: 2; Published: 17-Dec-2003; DatasheetDocument: 09-May-2002; Publisher: Altium Limited; ComponentLink1Description: Manufacturer Link; ComponentLink1URL: http://domino.kycon.com/internet/Products.html; Supplier 1: Digi-Key; Supplier Part Number 1: CP-002A-ND; Stock 1: 51043; Pricing 1: 1=0.6, 10=0.558, 25=0.5024, 50=0.4464, 100=0.4278, 250=0.3906, 500=0.372, 1000=0.3069, 2500=0.279 (USD); Mount: Through Hole; Color: Black; Contact Material: Copper Alloy,Copper; Contact Plating: Tin,Nickel; Housing Color: Black; Housing Material: Thermoplastic; Min Operating Temperature: -25°C; Max Operating Temperature: 85°C; Termination: Through Hole; Connector Type: Jack; Packaging: Bulk; Package Quantity: 500; Contact Gender: Male; Orientation: Horizontal; Diameter: 2.1mm; Lead Free: Lead Free; Flammability Rating: UL94 V-0
PRG1 = 20021311-00008T4LF: CONN RCPT 8POS 0.05 GOLD PCB; Manufacturer: Amphenol FCI; Contact Resistance: 30mR; Current Rating: 1A; Voltage Rating: 125V; Connector Type: Receptacle,Socket; Number of Positions: 8; Gender: Female; Pitch: 1.27mm; Row Spacing: 0.05inch; Stack Height: 4.3mm; Supplier 1: Digi-Key; Manufacturer Part Number: 20021311-00008T4LF; Stock 1: 15145; Pricing 1: 1=0.76, 10=0.711, 106=0.5449, 530=0.4738, 1060=0.3909, 5088=0.3435, 10070=0.3198 (USD); Mount: Through Hole; Contact Plating: Gold; Contact Material: Copper Alloy; Color: Black; Housing Material: Plastic; Min Operating Temperature: -40°C; Max Operating Temperature: 85°C; Package Quantity: 106; Number of Rows: 2; Packaging: Rail/Tube; Termination: Solder; Max Voltage Rating (AC): 125V; Number of Contacts: 8; Orientation: Straight; Length: 3.81mm; Depth: 3mm; Radiation Hardening: No; ComponentLink1URL: https://media.digikey.com/pdf/Data%20Sheets/FCI%20PDFs/Minitek%20127_Catalog.pdf?src-supplier=Digi-Key; ComponentLink1Description: https://media.digikey.com/pdf/Data%20Sheets/FCI%20PDFs/Minitek%20127_Catalog.pdf?src-supplier=Digi-Key; ComponentLink2URL: http://portal.fciconnect.com/Comergent/fci/drawing/20021311.pdf?src-supplier=Avnet; ComponentLink2Description: http://portal.fciconnect.com/Comergent/fci/drawing/20021311.pdf?src-supplier=Avnet; ComponentLink3URL: http://portal.fciconnect.com/Comergent/fci/drawing/20021311.pdf?src-supplier=Avnet+Europe; ComponentLink3Description: http://portal.fciconnect.com/Comergent/fci/drawing/20021311.pdf?src-supplier=Avnet+Europe; ComponentLink4URL: http://portal.fciconnect.com/Comergent//fci/drawing/20021311.pdf?src-supplier=Mouser; ComponentLink4Description: http://portal.fciconnect.com/Comergent//fci/drawing/20021311.pdf?src-supplier=Mouser; Supplier Part Number 1: 609-3753-ND
R1#1 = RC0603JR-07300RL: RES SMD 300 OHM 5% 1/10W 0603; Manufacturer: Yageo; Resistance: 300R; Power Rating: 100mW; Voltage Rating: 75V; Temperature Coefficient: 100ppm/°C; Voltage Rating (DC): 50V; Supplier 1: Digi-Key; Manufacturer Part Number: RC0603JR-07300RL; Stock 1: 150; Pricing 1: 1=0.1, 10=0.02, 100=0.0081, 1000=0.0036, 2500=0.0031 (USD); Case/Package: 0603; Number of Pins: 2; Weight: 7.1E-05oz; Case Code (Imperial): 0603; Case Code (Metric): 1608; Min Operating Temperature: -55°C; Max Operating Temperature: 155°C; Tolerance: 5%; Packaging: Tape and Reel; Termination: SMD/SMT; Composition: Thick Film; Military Standard: Not; Length: 1.6mm; Height: 0.45mm; Width: 0.8mm; Depth: 0.8mm; REACH SVHC: Unknown; Lead Free: Lead Free; ComponentLink1URL: http://www.farnell.com/datasheets/2167052.pdf?src-supplier=Farnell; ComponentLink1Description: http://www.farnell.com/datasheets/2167052.pdf?src-supplier=Farnell; ComponentLink2URL: http://www.yageo.com/documents/recent/PYu-RC0603_51_RoHS_L_7.pdf?src-supplier=Future+Electronics; ComponentLink2Description: http://www.yageo.com/documents/recent/PYu-RC0603_51_RoHS_L_7.pdf?src-supplier=Future+Electronics; ComponentLink3URL: http://www.mouser.com/ds/2/447/RC0603-1212058.pdf?src-supplier=Mouser; ComponentLink3Description: http://www.mouser.com/ds/2/447/RC0603-1212058.pdf?src-supplier=Mouser; ComponentLink4URL: http://components.arrow.com/part/dataview/0323_03543424?src-supplier=Arrow+Europe; ComponentLink4Description: http://components.arrow.com/part/dataview/0323_03543424?src-supplier=Arrow+Europe; ComponentLink5URL: http://www.yageo.com/documents/recent/PYu-RC_Group_51_RoHS_L_9.pdf?src-supplier=Digi-Key; ComponentLink5Description: http://www.yageo.com/documents/recent/PYu-RC_Group_51_RoHS_L_9.pdf?src-supplier=Digi-Key; ComponentLink6URL: http://www.yageo.com/documents/recent/PYu-RC_Group_51_RoHS_L_10.pdf?src-supplier=Digi-Key; ComponentLink6Description: http://www.yageo.com/documents/recent/PYu-RC_Group_51_RoHS_L_10.pdf?src-supplier=Digi-Key; ComponentLink7URL: http://www.farnell.com/datasheets/1868787.pdf?src-supplier=Element14; ComponentLink7Description: http://www.farnell.com/datasheets/1868787.pdf?src-supplier=Element14; Supplier Part Number 1: 311-300GRDKR-ND
R1#2 R2#2 R3#2 R4 = RC0603FR-071KL: RES SMD 1K OHM 1% 1/10W 0603; Manufacturer: Yageo; Resistance: 1kR; Power Rating: 100mW; Temperature Coefficient: 100ppm/°C; Voltage Rating: 50V; Supplier 1: Digi-Key; Manufacturer Part Number: RC0603FR-071KL; Stock 1: 48702346; Pricing 1: 1=0.1, 10=0.024, 100=0.0097, 1000=0.0044, 2500=0.0038 (USD); Case/Package: 0603; Case Code (Imperial): 0603; Case Code (Metric): 1608; Contact Plating: Tin,Matte; Min Operating Temperature: -55°C; Max Operating Temperature: 155°C; Tolerance: 1%; Packaging: Tape and Reel; Military Standard: Not; Termination: SMD/SMT; Composition: Thick Film; Length: 1.6mm; Height: 0.45mm; Depth: 0.8mm; Radiation Hardening: No; REACH SVHC: No SVHC; Lead Free: Lead Free; ComponentLink1URL: http://documents.rs-components.com/techlib://itc_doclist_GB.htm?stockno=5048928&src-supplier=RSComponents; ComponentLink1Description: http://documents.rs-components.com/techlib://itc_doclist_GB.htm?stockno=5048928&src-supplier=RSComponents; ComponentLink2URL: http://www.yageo.com/documents/recent/PYu-RC0603_51_RoHS_L_4.pdf?src-supplier=Avnet+Europe; ComponentLink2Description: http://www.yageo.com/documents/recent/PYu-RC0603_51_RoHS_L_4.pdf?src-supplier=Avnet+Europe; ComponentLink3URL: http://www.farnell.com/datasheets/2167052.pdf?src-supplier=Element14; ComponentLink3Description: http://www.farnell.com/datasheets/2167052.pdf?src-supplier=Element14; ComponentLink4URL: http://www.farnell.com/datasheets/1868787.pdf?src-supplier=Element14; ComponentLink4Description: http://www.farnell.com/datasheets/1868787.pdf?src-supplier=Element14; ComponentLink5URL: http://www.yageo.com/documents/recent/PYu-RC_Group_51_RoHS_L_2.pdf?src-supplier=Avnet; ComponentLink5Description: http://www.yageo.com/documents/recent/PYu-RC_Group_51_RoHS_L_2.pdf?src-supplier=Avnet; ComponentLink6URL: https://www.verical.com/server-webapp/html/getDatasheet?partID=404327&src-supplier=Verical; ComponentLink6Description: https://www.verical.com/server-webapp/html/getDatasheet?partID=404327&src-supplier=Verical; ComponentLink7URL: http://www.farnell.com/datasheets/443971.pdf?src-supplier=Element14; ComponentLink7Description: http://www.farnell.com/datasheets/443971.pdf?src-supplier=Element14; Supplier Part Number 1: 311-1.00KHRDKR-ND
R2#1 = RC0603JR-07330RL: RES SMD 330 OHM 5% 1/10W 0603; Manufacturer: Yageo; Resistance: 330R; Power Rating: 100mW; Voltage Rating (DC): 50V; Temperature Coefficient: 100ppm/°C; Supplier 1: Digi-Key; Manufacturer Part Number: RC0603JR-07330RL; Stock 1: 5319563; Pricing 1: 1=0.1, 10=0.02, 100=0.0081, 1000=0.0036, 2500=0.0031 (USD); Case/Package: 0603; Number of Pins: 2; Case Code (Imperial): 0603; Case Code (Metric): 1608; Min Operating Temperature: -55°C; Max Operating Temperature: 155°C; Tolerance: 5%; Packaging: Tape and Reel; Voltage Rating: 50V; Package Quantity: 5000; Termination: SMD/SMT; Composition: Thick Film; Military Standard: Not; Length: 1.6mm; Height: 0.45mm; Width: 0.8mm; Depth: 0.8mm; REACH SVHC: No SVHC; Lead Free: Lead Free; ComponentLink1URL: http://www.farnell.com/datasheets/1868787.pdf?src-supplier=Element14; ComponentLink1Description: http://www.farnell.com/datasheets/1868787.pdf?src-supplier=Element14; ComponentLink2URL: http://www.farnell.com/datasheets/443971.pdf?src-supplier=Element14; ComponentLink2Description: http://www.farnell.com/datasheets/443971.pdf?src-supplier=Element14; ComponentLink3URL: https://www.verical.com/server-webapp/html/getDatasheet?partID=342831&src-supplier=Verical; ComponentLink3Description: https://www.verical.com/server-webapp/html/getDatasheet?partID=342831&src-supplier=Verical; ComponentLink4URL: http://www.mouser.com/catalog/specsheets/RC0603.pdf?src-supplier=Mouser; ComponentLink4Description: http://www.mouser.com/catalog/specsheets/RC0603.pdf?src-supplier=Mouser; Supplier Part Number 1: 311-330GRDKR-ND
R3#1 = RC0603FR-072K43L: RES SMD 2.43K OHM 1% 1/10W 0603; Manufacturer: Yageo; Resistance: 2.43kR; Power Rating: 100mW; Voltage Rating: 50V; Temperature Coefficient: 100ppm/°C; Supplier 1: Digi-Key; Manufacturer Part Number: RC0603FR-072K43L; Stock 1: 703719; Pricing 1: 1=0.1, 10=0.024, 100=0.0097, 1000=0.0044, 2500=0.0038 (USD); Case/Package: 0603; Case Code (Metric): 1608; Case Code (Imperial): 0603; Min Operating Temperature: -55°C; Max Operating Temperature: 155°C; Tolerance: 1%; Packaging: Tape and Reel; Composition: Thick Film; Termination: SMD/SMT; Military Standard: Not; Voltage Rating (DC): 50V; Package Quantity: 1; Number of Terminations: 2; Max Power Dissipation: 100mW; Features: Moisture Resistant; Length: 1.6mm; Height: 0.022inch; Width: 0.031inch; Depth: 0.8mm; Lead Free: Lead Free; ComponentLink1URL: https://www.verical.com/server-webapp/html/getDatasheet?partID=28835&src-supplier=Verical; ComponentLink1Description: https://www.verical.com/server-webapp/html/getDatasheet?partID=28835&src-supplier=Verical; ComponentLink2URL: http://www.yageo.com/documents/recent/PYu-RC_Group_51_RoHS_L_9.pdf?src-supplier=Digi-Key; ComponentLink2Description: http://www.yageo.com/documents/recent/PYu-RC_Group_51_RoHS_L_9.pdf?src-supplier=Digi-Key; ComponentLink3URL: http://www.yageo.com/documents/recent/PYu-RC_Group_51_RoHS_L_10.pdf?src-supplier=Digi-Key; ComponentLink3Description: http://www.yageo.com/documents/recent/PYu-RC_Group_51_RoHS_L_10.pdf?src-supplier=Digi-Key; ComponentLink4URL: http://www.mouser.com/catalog/specsheets/RC0603.pdf?src-supplier=Mouser; ComponentLink4Description: http://www.mouser.com/catalog/specsheets/RC0603.pdf?src-supplier=Mouser; Supplier Part Number 1: 311-2.43KHRDKR-ND
R5 = RMCF0603FT390R: Res Thick Film 0603 390 Ohm 1% 0.1W ±100ppm/°C Molded SMD Paper T/R; Manufacturer: Stackpole Electronics; Resistance: 390R; Max Power Dissipation: 100mW; Supplier 1: Digi-Key; Manufacturer Part Number: RMCF0603FT390R; Stock 1: 0; Pricing 1: 1=0.1, 10=0.017, 100=0.0068, 1000=0.0031, 2500=0.0027 (USD); Mount: Surface Mount; Case/Package: 0603; Case Code (Metric): 1608; Case Code (Imperial): 0603; Contact Plating: Tin,Matte; Min Operating Temperature: -55°C; Max Operating Temperature: 155°C; Packaging: Tape and Reel; Tolerance: 1%; Composition: Thick Film; Number of Terminations: 2; Temperature Coefficient: 100ppm/°C; Features: Automotive AEC-Q200; Length: 0.061inch; Height: 0.022inch; Width: 0.031inch; Radiation Hardening: No; Supplier Part Number 1: RMCF0603FT390RDKR-ND
U1 = LM1117MP-3.3/NOPB: Space saving 800-mA low-dropout linear regulator with internal current limit 4-SOT-223 0 to 125; Manufacturer: TI National Semiconductor; Max Input Voltage: 15V; Dropout Voltage: 1.2V; Output Voltage: 3.3V; Number of Outputs: 1; Max Output Current: 800mA; Polarity: Positive; Quiescent Current: 10mA; Output Voltage Accuracy: 1%; Output Type: Fixed; Supplier 1: Digi-Key; Supplier Part Number 1: LM1117MP-3.3/NOPBDKR-ND; Manufacturer Part Number: LM1117MP-3.3/NOPB; Stock 1: 43034; Pricing 1: 1=1.14, 10=1.015, 100=0.7912, 500=0.6536 (USD); Mount: Surface Mount; Case/Package: SOT-223; Number of Pins: 4; Min Operating Temperature: 0°C; Max Operating Temperature: 125°C; Packaging: Tape and Reel; Output Current: 800mA; Nominal Output Voltage: 3.3V; Accuracy: 1%; Current Rating: 800mA; Package Quantity: 1000; Number of Regulators: 1; Min Current Limit: 800mA; Length: 6.5mm; Height: 1.6mm; Width: 3.56mm; Radiation Hardening: No; REACH SVHC: No SVHC; Lead Free: Lead Free; ComponentLink1URL: https://www.verical.com/server-webapp/html/getDatasheet?partID=112131&src-supplier=Verical; ComponentLink1Description: https://www.verical.com/server-webapp/html/getDatasheet?partID=112131&src-supplier=Verical; ComponentLink2URL: http://www.ti.com/lit/ds/symlink/lm1117-n.pdf?src-supplier=Avnet+Asia; ComponentLink2Description: http://www.ti.com/lit/ds/symlink/lm1117-n.pdf?src-supplier=Avnet+Asia; ComponentLink3URL: http://www.ti.com/lit/ds/symlink/lm1117.pdf?src-supplier=Digi-Key; ComponentLink3Description: http://www.ti.com/lit/ds/symlink/lm1117.pdf?src-supplier=Digi-Key; ComponentLink4URL: http://www.ti.com/lit/ds/symlink/lm1117-n.pdf?src-supplier=Avnet+Europe; ComponentLink4Description: http://www.ti.com/lit/ds/symlink/lm1117-n.pdf?src-supplier=Avnet+Europe; ComponentLink5URL: https://www.distrelec.com/ishop/Datasheets/lm1117_eng_tds.pdf?src-supplier=Distrelec; ComponentLink5Description: https://www.distrelec.com/ishop/Datasheets/lm1117_eng_tds.pdf?src-supplier=Distrelec
U2 = STM32F205RCT6: MCU 32-bit STM32 ARM Cortex M3 RISC 256KB Flash 2.5V/3.3V 64-Pin LQFP Tray; Manufacturer: STMicroelectronics; RAM Size: 100KB; Max Power Dissipation: 444mW; Interface: SDIO,I2C,SPI,USB,CAN,IrDA,MMC,UART,USART,LIN,I2S; Number of I/Os: 51; Number of Timers/Counters: 14; Max Supply Voltage: 3.6V; Number of PWM Channels: 2; Frequency: 120MHz; Min Supply Voltage: 1.8V; Number of Programmable I/O: 16; Data Bus Width: 32b; Oscillator Type: Internal; Number of SPI Channels: 3; Number of Ethernet Channels: 1; Watchdog Timer: Yes; Peripherals: Brown-out Detect/Reset,POR,PWM,WDT,DMA,LCD,I2C; Supplier 1: Digi-Key; Manufacturer Part Number: STM32F205RCT6; Stock 1: 1348; Pricing 1: 1=7.79, 10=7.04, 160=5.8288, 640=5.0756, 1120=4.4207 (USD); Case/Package: LQFP; Number of Pins: 64; Min Operating Temperature: -40°C; Max Operating Temperature: 85°C; Package Quantity: 160; Packaging: Tray; Max Frequency: 120MHz; Number of USB Channels: 2; Number of ADC Channels: 16; Number of I2C Channels: 3; Memory Type: FLASH; Memory Size: 256KB; Number of UART Channels: 2; Core Architecture: ARM; Length: 10.2mm; Height: 1.45mm; Width: 10.2mm; Radiation Hardening: No; REACH SVHC: No SVHC; Lead Free: Lead Free; ComponentLink1URL: http://www.farnell.com/datasheets/1776949.pdf?src-supplier=Element14; ComponentLink1Description: http://www.farnell.com/datasheets/1776949.pdf?src-supplier=Element14; ComponentLink2URL: http://www.st.com/web/en/resource/technical/document/datasheet/CD00237391.pdf?src-supplier=Future+Electronics; ComponentLink2Description: http://www.st.com/web/en/resource/technical/document/datasheet/CD00237391.pdf?src-supplier=Future+Electronics; ComponentLink3URL: http://www.st.com/web/en/resource/technical/document/datasheet/CD00237391.pdf?src-supplier=Avnet+Asia; ComponentLink3Description: http://www.st.com/web/en/resource/technical/document/datasheet/CD00237391.pdf?src-supplier=Avnet+Asia; ComponentLink4URL: http://www.produktinfo.conrad.com/datenblaetter/1000000-1099999/001075498-da-01-en-MCU_256KB_STM32F205RCT6_LQFP_64_STM.pdf?src-supplier=Conrad; ComponentLink4Description: http://www.produktinfo.conrad.com/datenblaetter/1000000-1099999/001075498-da-01-en-MCU_256KB_STM32F205RCT6_LQFP_64_STM.pdf?src-supplier=Conrad; Supplier Part Number 1: 497-11154-ND
X1 = ABM3-25.000MHZ-D2Y-T: CRYSTAL 25.0000MHZ 18PF SMD; Manufacturer: Abracon; Frequency Tolerance: 20ppm; ESR (Equivalent Series Resistance): 30R; Frequency Stability: 30ppm; Supplier 1: Digi-Key; Manufacturer Part Number: ABM3-25.000MHZ-D2Y-T; Stock 1: 27285; Pricing 1: 1=0.73, 10=0.605, 50=0.5446, 100=0.484, 500=0.4598 (USD); Mount: Surface Mount; Case/Package: CSMD; Number of Pins: 2; Min Operating Temperature: -40°C; Max Operating Temperature: 85°C; Frequency: 25MHz; Load Capacitance: 18pF; Tolerance: 20ppm; Packaging: Tape and Reel; Package Quantity: 1000; Termination: SMD/SMT; Composition: Ceramic; Series Resistance: 30R; Length: 5mm; Height: 0.051inch; Width: 3.2mm; Depth: 3.2mm; REACH SVHC: Yes; Lead Free: Lead Free; ComponentLink1URL: http://www.abracon.com/Resonators/abm3.pdf?src-supplier=Future+Electronics; ComponentLink1Description: http://www.abracon.com/Resonators/abm3.pdf?src-supplier=Future+Electronics; ComponentLink2URL: https://abracon.com/Resonators/abm3.pdf?src-supplier=Digi-Key; ComponentLink2Description: https://abracon.com/Resonators/abm3.pdf?src-supplier=Digi-Key; ComponentLink3URL: http://www.farnell.com/datasheets/1754353.pdf?src-supplier=Element14; ComponentLink3Description: http://www.farnell.com/datasheets/1754353.pdf?src-supplier=Element14; Supplier Part Number 1: 535-10645-6-ND